# EAGLE design Aria-Fissa-pcb (EAGLE 8.5.0)
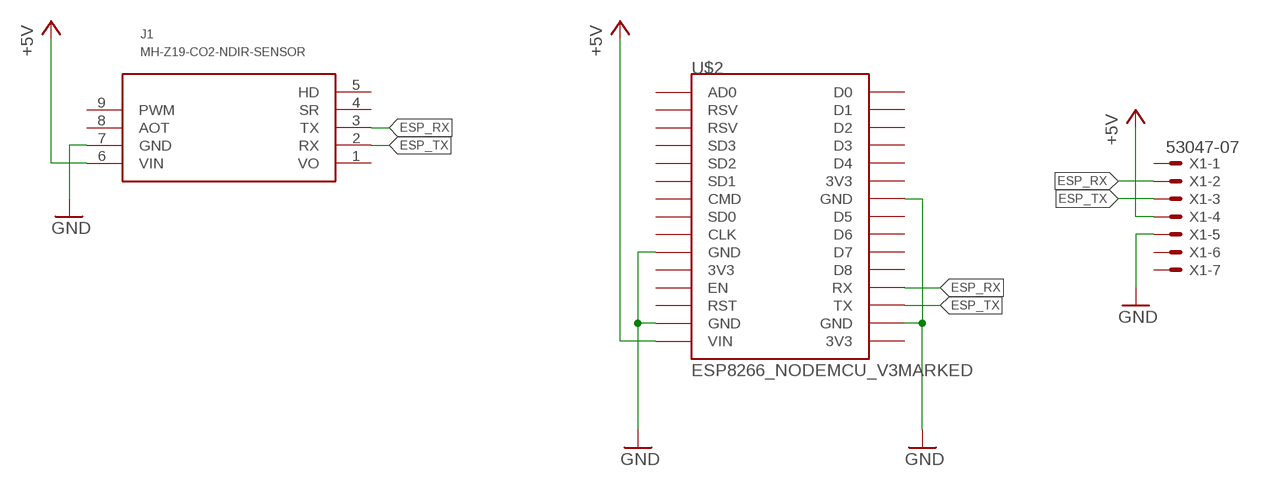
[diagram p0: schematic, sheet 1]

## Parts
J1  MH-Z19-CO2-NDIR-SENSOR  [MH-Z19]
U$2  ESP8266_NODEMCU_V3MARKED  [ESP8266_NODEMCU_V3_SMALL]
X1  53047-07  [53047-07]

## Nets
+5V: J1.6(VIN) U$2.VIN X1.4
ESP_RX: J1.3(TX) U$2.RX X1.2
ESP_TX: J1.2(RX) U$2.TX X1.3
GND: J1.7(GND) U$2.GND@0(GND) U$2.GND@1(GND) U$2.GND@2(GND) U$2.GND@3(GND) X1.5
Unconnected: J1.4(SR) J1.5(HD) J1.8(AOT) J1.9(PWM) U$2.3V3@0(3V3) U$2.3V3@1(3V3) U$2.3V3@2(3V3) U$2.AD0 U$2.CLK U$2.CMD U$2.D0 U$2.D1 U$2.D2 U$2.D3 U$2.D4 U$2.D5 U$2.D6 U$2.D7 U$2.D8 U$2.EN U$2.RST U$2.RSV@0(RSV) U$2.RSV@1(RSV) U$2.SD0 U$2.SD1 U$2.SD2 U$2.SD3 X1.1 X1.6 X1.7

## Power pins joined to a net without a drawn wire
VO: J1.1(VO)

## Library data of the parts
J1 = MY:MH-Z19: MH-Z19 - CO2 NDIR SENSOR
U$2 = MY:ESP8266_NODEMCU_V3: ESP12E DEVKIT BOARD
X1 = con-molex:53?-07: CONNECTOR wire to board 1.25 mm (.049 inch) pitch header; MF: MOLEX; MPN: 53047-0710-C; OC_FARNELL: 9732870; OC_NEWARK: 11M0149

## Board
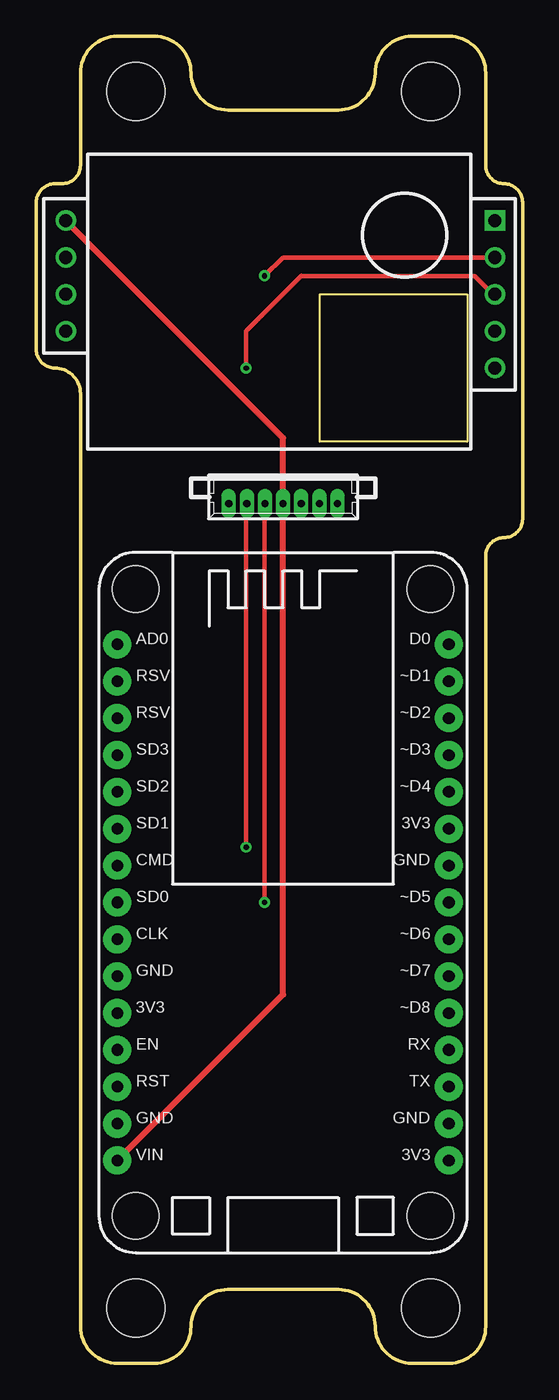
[diagram p1: board, top side]
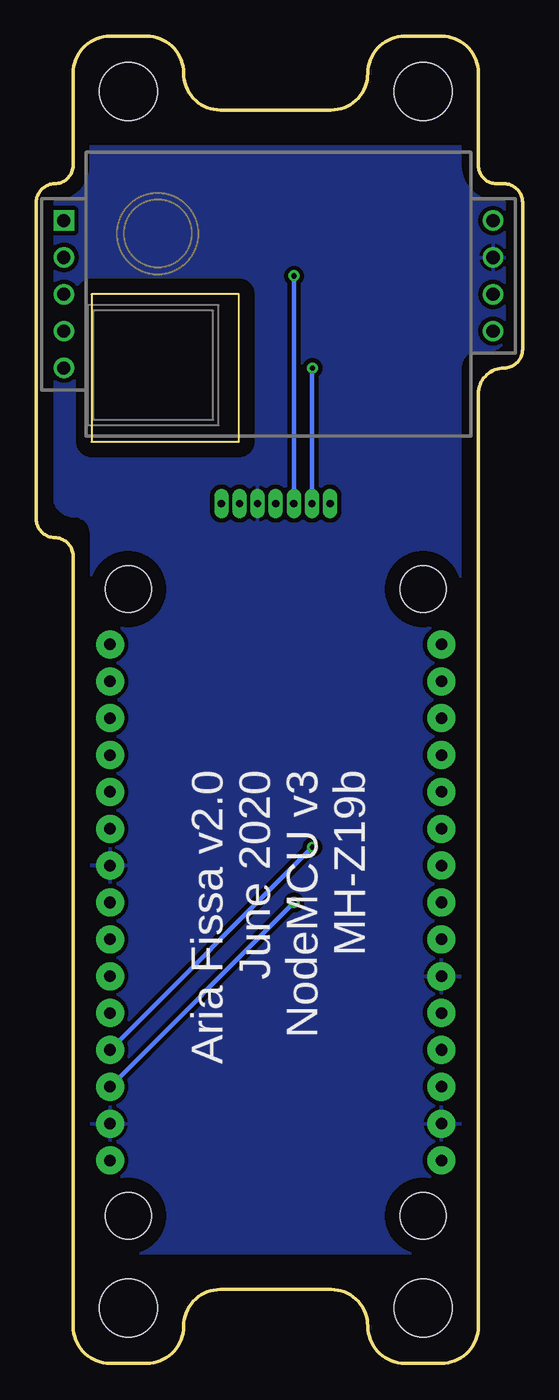
[diagram p2: board, bottom side, seen from below]

Size 33.53 x 91.44 mm. Coordinates in mm from the lower left corner, seen from the top.
Outline: 28.45,0 arc90 30.99,2.54 30.99,55.63 arc-90 32.26,56.9 arc90 33.53,58.17 33.53,80.01 arc90 32.26,81.28 arc-90 30.99,82.55 30.99,88.9 arc90 28.45,91.44 25.91,91.44 arc90 23.37,88.9 arc-90 20.83,86.36 13.21,86.36 arc-90 10.67,88.9 arc90 8.13,91.44 5.59,91.44 arc90 3.05,88.9 3.05,82.55 arc-90 1.78,81.28 1.27,81.28 arc90 0,80.01 0,69.85 arc90 1.27,68.58 arc-90 3.05,66.8 3.05,2.54 arc90 5.59,0 8.13,0 arc90 10.67,2.54 arc-90 13.21,5.08 20.83,5.08 arc-90 23.37,2.54 arc90 25.91,0 28.45,0
Outline: 19.56,73.66 29.72,73.66 29.72,63.5 19.56,63.5 19.56,73.66
Copper layers (1*16): Top 0.035mm / dielectric 1.5mm / Bottom 0.035mm
Design rules "default": minimum track width 6mil, minimum drill 0.35mm, track to track 6mil, track to pad 6mil, pad to pad 6mil, via to via 6mil, smd to smd 6mil, copper to edge 40mil, drill to drill 6mil, minimum pad ring 10mil, minimum via ring 8mil, stop-mask expansion 4mil, vias tented up to drill 0mil, thermal gap 10mil
Holes 4 mm at 6.86,3.81 27.18,3.81 6.86,87.63 27.18,87.63

### Footprints (pad centres in the part's own frame; a part is rotated, then mirrored left to right if it is on the bottom)
MH-Z19 = drill 0.9 square: 1 19.431,-1.27 | drill 0.9: 2 19.431,1.27; 3 19.431,3.81; 4 19.431,6.35; 5 19.431,8.89; 6 -10.16,-1.27; 7 -10.16,1.27; 8 -10.16,3.81; 9 -10.16,6.35
ESP8266_NODEMCU_V3_SMALL = drill 0.8 pad 1.93: 3V3@0 -11.43,-7.62; 3V3@1 11.43,5.08; 3V3@2 11.43,-17.78; AD0 -11.43,17.78; CLK -11.43,-2.54; CMD -11.43,2.54; D0 11.43,17.78; D1 11.43,15.24; D2 11.43,12.7; D3 11.43,10.16; D4 11.43,7.62; D5 11.43,0; D6 11.43,-2.54; D7 11.43,-5.08; D8 11.43,-7.62; EN -11.43,-10.16; GND@0 -11.43,-5.08; GND@1 -11.43,-15.24; GND@2 11.43,2.54; GND@3 11.43,-15.24; RST -11.43,-12.7; RSV@0 -11.43,15.24; RSV@1 -11.43,12.7; RX 11.43,-10.16; SD0 -11.43,0; SD1 -11.43,5.08; SD2 -11.43,7.62; SD3 -11.43,10.16; TX 11.43,-12.7; VIN -11.43,-17.78 | hole 3.2: -10.16,21.59; 10.16,21.59; 10.16,-21.59; -10.16,-21.59
53047-07 = drill 0.5 pad 0.698 long: 1 3.75,0.45; 2 2.5,0.45; 3 1.25,0.45; 4 0,0.45; 5 -1.25,0.45; 6 -2.5,0.45; 7 -3.75,0.45

### Placement (x,y rotation side)
J1  12.19,77.47 180 bottom
U$2  17.02,31.75 0 top
X1  17.02,59.69 180 top

### Tracks (layer width: path | path; a pad name or v marks a point on that pad's centre or on a via)
+5V
  Top 0.406: U$2.VIN 17.02,25.4 X1.4 17.02,63.75 J1.6
ESP_RX  (via drill 0.35)
  Top 0.305: v14.48,35.56 14.48,59.2 X1.2 | J1.3 31.48,73.66 30.23,74.91 18.31,74.91 18.29,74.93 14.48,71.12 v14.48,68.58
  Bottom 0.305: U$2.RX v14.48,35.56 | X1.2 14.52,68.54 v14.48,68.58
ESP_TX  (via drill 0.35)
  Top 0.305: v15.75,31.75 15.75,59.22 X1.3 | v15.75,74.93 17.02,76.2 J1.2
  Bottom 0.305: U$2.TX v15.75,31.75 | X1.3 15.75,59.26 v15.75,74.93
GND
  pour Bottom (isolate 0.305): 6.86,7.62 27.18,7.62 arc90 29.72,10.16 29.72,57.15 arc-90 30.99,58.42 arc90 32.26,59.69 32.26,82.55 arc90 30.99,83.82 2.29,83.82 arc90 1.02,82.55 1.02,71.12 arc90 2.29,69.85 3.05,69.85 arc-90 4.32,68.58 4.32,10.16 arc90

### Text on the board
bPlace: Aria Fissa v2.0 / June 2020 / NodeMCU v3 / MH-Z19b